# Altium project LED_48.PrjPcb
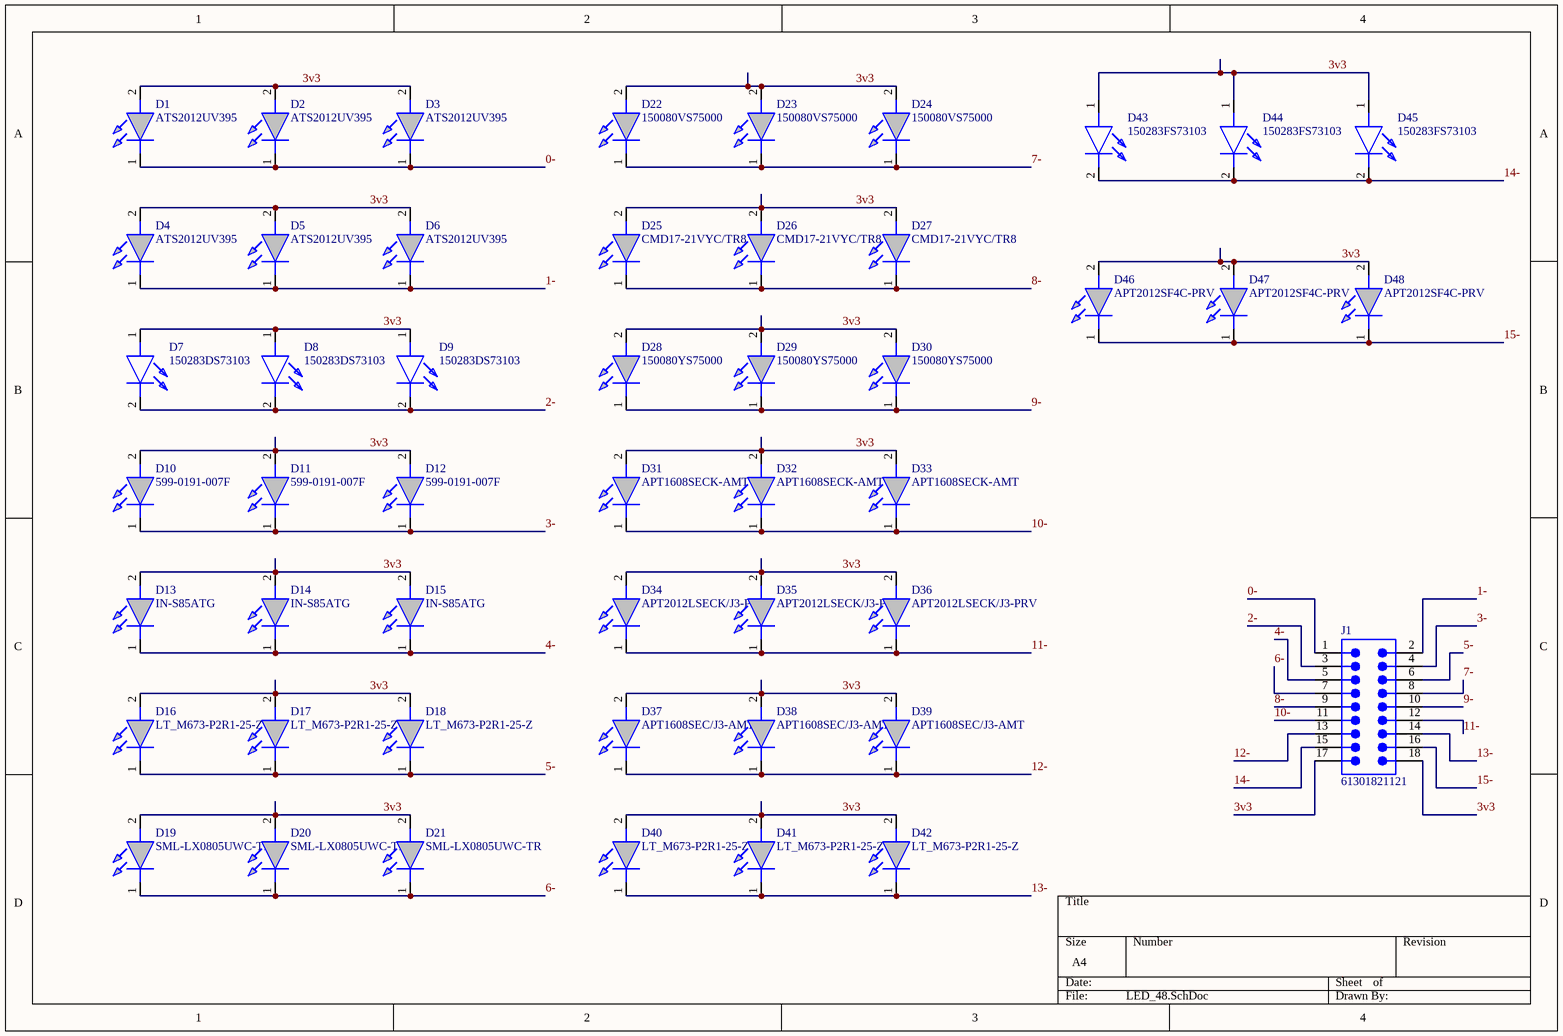
[diagram p0: LED_48.SchDoc]
1 sheet, 49 parts. Net scope: global (net labels, ports and power ports of the same name join across sheets).
Board file: LED_48.PcbDoc

## Sheet LED_48.SchDoc
size A4; SheetNumber: 1; SheetTotal: 1

### Parts
D1  ATS2012UV395  [ATS2012UV395]
D2  ATS2012UV395  [ATS2012UV395]
D3  ATS2012UV395  [ATS2012UV395]
D4  ATS2012UV395  [ATS2012UV395]
D5  ATS2012UV395  [ATS2012UV395]
D6  ATS2012UV395  [ATS2012UV395]
D7  150283DS73103  [150283DS73103]
D8  150283DS73103  [150283DS73103]
D9  150283DS73103  [150283DS73103]
D10  599-0191-007F  [LEDC2012X90N]
D11  599-0191-007F  [LEDC2012X90N]
D12  599-0191-007F  [LEDC2012X90N]
D13  IN-S85ATG  [LEDC2012X110N]
D14  IN-S85ATG  [LEDC2012X110N]
D15  IN-S85ATG  [LEDC2012X110N]
D16  LT_M673-P2R1-25-Z  [LEDM2214X140N]
D17  LT_M673-P2R1-25-Z  [LEDM2214X140N]
D18  LT_M673-P2R1-25-Z  [LEDM2214X140N]
D19  SML-LX0805UWC-TR  [LEDC2012X80N]
D20  SML-LX0805UWC-TR  [LEDC2012X80N]
D21  SML-LX0805UWC-TR  [LEDC2012X80N]
D22  150080VS75000  [LEDC2012X80N]
D23  150080VS75000  [LEDC2012X80N]
D24  150080VS75000  [LEDC2012X80N]
D25  CMD17-21VYC/TR8  [LEDC2012X120N]
D26  CMD17-21VYC/TR8  [LEDC2012X120N]
D27  CMD17-21VYC/TR8  [LEDC2012X120N]
D28  150080YS75000  [LEDC2012X80N]
D29  150080YS75000  [LEDC2012X80N]
D30  150080YS75000  [LEDC2012X80N]
D31  APT1608SECK-AMT  [LEDC1608X85N]
D32  APT1608SECK-AMT  [LEDC1608X85N]
D33  APT1608SECK-AMT  [LEDC1608X85N]
D34  APT2012LSECK/J3-PRV  [LEDC2012X75N]
D35  APT2012LSECK/J3-PRV  [LEDC2012X75N]
D36  APT2012LSECK/J3-PRV  [LEDC2012X75N]
D37  APT1608SEC/J3-AMT  [APT1608SECJ3AMT]
D38  APT1608SEC/J3-AMT  [APT1608SECJ3AMT]
D39  APT1608SEC/J3-AMT  [APT1608SECJ3AMT]
D40  LT_M673-P2R1-25-Z  [LEDM2214X140N]
D41  LT_M673-P2R1-25-Z  [LEDM2214X140N]
D42  LT_M673-P2R1-25-Z  [LEDM2214X140N]
D43  150283FS73103  [150283DS73103]
D44  150283FS73103  [150283DS73103]
D45  150283FS73103  [150283DS73103]
D46  APT2012SF4C-PRV  [LEDC2012X85N]
D47  APT2012SF4C-PRV  [LEDC2012X85N]
D48  APT2012SF4C-PRV  [LEDC2012X85N]
J1  61301821121  [61301821121]

### Nets
0-: D1.1(K) D2.1(K) D3.1(K) J1.1
1-: D4.1(K) D5.1(K) D6.1(K) J1.2
2-: D7.2(K) D8.2(K) D9.2(K) J1.3
3-: D10.1(K) D11.1(K) D12.1(K) J1.4
3v3: D1.2(A) D2.2(A) D3.2(A) D4.2(A) D5.2(A) D6.2(A) D7.1(A) D8.1(A) D9.1(A) D10.2(A) D11.2(A) D12.2(A) D13.2(A) D14.2(A) D15.2(A) D16.2(A) D17.2(A) D18.2(A) D19.2(A) D20.2(A) D21.2(A) D22.2(A) D23.2(A) D24.2(A) D25.2(A) D26.2(A) D27.2(A) D28.2(A) D29.2(A) D30.2(A) D31.2(A) D32.2(A) D33.2(A) D34.2(A) D35.2(A) D36.2(A) D37.2(A) D38.2(A) D39.2(A) D40.2(A) D41.2(A) D42.2(A) D43.1(A) D44.1(A) D45.1(A) D46.2(A) D47.2(A) D48.2(A) J1.17 J1.18
4-: D13.1(K) D14.1(K) D15.1(K) J1.5
5-: D16.1(K) D17.1(K) D18.1(K) J1.6
6-: D19.1(K) D20.1(K) D21.1(K) J1.7
7-: D22.1(K) D23.1(K) D24.1(K) J1.8
8-: D25.1(K) D26.1(K) D27.1(K) J1.9
9-: D28.1(K) D29.1(K) D30.1(K) J1.10
10-: D31.1(K) D32.1(K) D33.1(K) J1.11
11-: D34.1(K) D35.1(K) D36.1(K) J1.12
12-: D37.1(K) D38.1(K) D39.1(K) J1.13
13-: D40.1(K) D41.1(K) D42.1(K) J1.14
14-: D43.2(K) D44.2(K) D45.2(K) J1.15
15-: D46.1(K) D47.1(K) D48.1(K) J1.16

### Library data of the parts
D1-D6 = ATS2012UV395: Standard LEDs - SMD 2x1.2mm UV SMD; Manufacturer_Name: Kingbright; Geometry.Height: 1mm; Manufacturer_Part_Number: ATS2012UV395; Mouser Part Number: 604-ATS2012UV395; Mouser Price/Stock: https://www.mouser.co.uk/ProductDetail/Kingbright/ATS2012UV395?qs=%252BEew9%252B0nqrCgwxEBSEvg7Q%3D%3D; Arrow Part Number: ATS2012UV395; Arrow Price/Stock: https://www.arrow.com/en/products/ats2012uv395/kingbright; Datasheet Link: https://www.arrow.com/en/products/ats2012uv395/kingbright
D7-D9 D43-D45 = 150283DS73103: LED; Manufacturer_Name: Wurth Elektronik; Datasheet Link: https://www.mouser.jp/datasheet/2/445/150283DS73103-1838914.pdf; Height: 0.85mm; Manufacturer_Part_Number: 150283DS73103; Mouser Part Number: 710-150283DS73103; Mouser Price/Stock: https://www.mouser.co.uk/ProductDetail/Wurth-Elektronik/150283DS73103/?qs=GedFDFLaBXFC8uVfOF%252Bhgw%3D%3D
D10-D12 = 599-0191-007F: Standard LEDs - SMD SMD 0805 BLUE; Manufacturer_Name: Dialight; Geometry.Height: 0.9mm; Mouser Part Number: 645-599-0191-007F; Mouser Price/Stock: https://www.mouser.co.uk/ProductDetail/Dialight/599-0191-007F?qs=gTYE2QTfZfTbWzs5Ohdbbg%3D%3D; Manufacturer_Part_Number: 599-0191-007F; Datasheet Link: https://componentsearchengine.com/Datasheets/1/599-0191-007F.pdf
D13-D15 = IN-S85ATG: Standard LEDs - SMD True Green LED; Manufacturer_Name: Inolux; Geometry.Height: 1.1mm; Mouser Part Number: 743-IN-S85ATG; Mouser Price/Stock: https://www.mouser.co.uk/ProductDetail/Inolux/IN-S85ATG?qs=fAHHVMwC%252BbhWv0EIR%2FKEPw%3D%3D; Manufacturer_Part_Number: IN-S85ATG; Datasheet Link: http://www.inolux-corp.com/datasheet/SMDLED/Mono%20Color%20Top%20View/IN-S85AT%20Series_V1.1.pdf
D16-D18 D40-D42 = LT_M673-P2R1-25-Z: Standard LEDs - SMD True Green, 532nm 140mcd, 10mA; Manufacturer_Name: OSRAM; Manufacturer_Part_Number: LT M673-P2R1-25-Z; Geometry.Height: 1.4mm; Mouser Part Number: 720-LTM673P2R125Z; Mouser Price/Stock: https://www.mouser.co.uk/ProductDetail/OSRAM-Opto-Semiconductors/LT-M673-P2R1-25-Z?qs=nTDll3UaDK7W5Gk6Y9krcg%3D%3D; Datasheet Link: https://media.digikey.com/pdf/Data%20Sheets/Osram%20PDFs/LT_M673_Version1.1_June2013.pdf
D19-D21 = SML-LX0805UWC-TR: Standard LEDs - SMD White, Water Clear 3.5V, 150mcd; Manufacturer_Name: Dialight; Manufacturer_Part_Number: 599-0191-007F; Geometry.Height: 0.9mm; Mouser Part Number: 645-599-0191-007F; Mouser Price/Stock: https://www.mouser.co.uk/ProductDetail/Dialight/599-0191-007F?qs=gTYE2QTfZfTbWzs5Ohdbbg%3D%3D; Datasheet Link: https://componentsearchengine.com/Datasheets/1/599-0191-007F.pdf
D22-D24 = 150080VS75000: Standard LEDs - SMD WL-SMCW SMDMono TpVw Waterclr 0805 BrtGrn; Manufacturer_Name: Dialight; Manufacturer_Part_Number: 599-0191-007F; Geometry.Height: 0.9mm; Mouser Part Number: 645-599-0191-007F; Mouser Price/Stock: https://www.mouser.co.uk/ProductDetail/Dialight/599-0191-007F?qs=gTYE2QTfZfTbWzs5Ohdbbg%3D%3D; Datasheet Link: https://componentsearchengine.com/Datasheets/1/599-0191-007F.pdf
D25-D27 = CMD17-21VYC/TR8: Standard LEDs - SMD YELLOW WATER CLEAR; Manufacturer_Name: Dialight; Manufacturer_Part_Number: 599-0191-007F; Geometry.Height: 0.9mm; Mouser Part Number: 645-599-0191-007F; Mouser Price/Stock: https://www.mouser.co.uk/ProductDetail/Dialight/599-0191-007F?qs=gTYE2QTfZfTbWzs5Ohdbbg%3D%3D; Datasheet Link: https://componentsearchengine.com/Datasheets/1/599-0191-007F.pdf
D28-D30 = SML-LX0805UWC-TR: Standard LEDs - SMD WL-SMCW SMDMono TpVw Waterclr 0805 Yellow; Manufacturer_Name: Dialight; Manufacturer_Part_Number: 599-0191-007F; Geometry.Height: 0.9mm; Mouser Part Number: 645-599-0191-007F; Mouser Price/Stock: https://www.mouser.co.uk/ProductDetail/Dialight/599-0191-007F?qs=gTYE2QTfZfTbWzs5Ohdbbg%3D%3D; Datasheet Link: https://componentsearchengine.com/Datasheets/1/599-0191-007F.pdf
D31-D33 = APT1608SECK-AMT: Standard LEDs - SMD 1.6x0.8mm Orange; Manufacturer_Name: Dialight; Manufacturer_Part_Number: 599-0191-007F; Geometry.Height: 0.9mm; Mouser Part Number: 645-599-0191-007F; Mouser Price/Stock: https://www.mouser.co.uk/ProductDetail/Dialight/599-0191-007F?qs=gTYE2QTfZfTbWzs5Ohdbbg%3D%3D; Datasheet Link: https://componentsearchengine.com/Datasheets/1/599-0191-007F.pdf
D34-D36 = APT2012LSECK/J3-PRV: Standard LEDs - SMD 2.0X1.2MM LOW CRNT; Manufacturer_Name: Kingbright; Manufacturer_Part_Number: ATS2012UV395; Geometry.Height: 1mm; Mouser Part Number: 604-ATS2012UV395; Mouser Price/Stock: https://www.mouser.co.uk/ProductDetail/Kingbright/ATS2012UV395?qs=%252BEew9%252B0nqrCgwxEBSEvg7Q%3D%3D; Arrow Part Number: ATS2012UV395; Arrow Price/Stock: https://www.arrow.com/en/products/ats2012uv395/kingbright; Datasheet Link: https://www.arrow.com/en/products/ats2012uv395/kingbright
D37-D39 = APT1608SEC/J3-AMT: Standard LEDs - SMD 1.6x0.8mm Red; Manufacturer_Name: Kingbright; Manufacturer_Part_Number: ATS2012UV395; Geometry.Height: 1mm; Mouser Part Number: 604-ATS2012UV395; Mouser Price/Stock: https://www.mouser.co.uk/ProductDetail/Kingbright/ATS2012UV395?qs=%252BEew9%252B0nqrCgwxEBSEvg7Q%3D%3D; Arrow Part Number: ATS2012UV395; Arrow Price/Stock: https://www.arrow.com/en/products/ats2012uv395/kingbright; Datasheet Link: https://www.arrow.com/en/products/ats2012uv395/kingbright
D46-D48 = APT2012SF4C-PRV: Infrared Emitters IR 880nm 120 deg Water Clear 1 mW/sr; Manufacturer_Name: Kingbright; Manufacturer_Part_Number: ATS2012UV395; Geometry.Height: 1mm; Mouser Part Number: 604-ATS2012UV395; Mouser Price/Stock: https://www.mouser.co.uk/ProductDetail/Kingbright/ATS2012UV395?qs=%252BEew9%252B0nqrCgwxEBSEvg7Q%3D%3D; Arrow Part Number: ATS2012UV395; Arrow Price/Stock: https://www.arrow.com/en/products/ats2012uv395/kingbright; Datasheet Link: https://www.arrow.com/en/products/ats2012uv395/kingbright
J1 = CMP-1502-01101-2: NexarPartId: 32855553; Operating Supply Voltage: 250V; Pitch: 2.54mm; Contact Resistance: 20mΩ; Number of Contacts: 18; Current Rating: 3A; Gender: Male; Connector Type: Male Pin; Number of Pins: 18; Number of Rows: 2; Row Spacing: 2.54mm; REACH SVHC: Unknown; Mount: Through Hole; Contact Mating Length: 5.9944mm; Contact Material: Copper; Color: Black; Orientation: Vertical; RoHS: Compliant; Contact Plating: Gold; Number of Positions: 18; Packaging: Bulk; Lead Pitch: 2.54mm; Termination: Solder